# Altium project Sahasrara_PCB.PrjPcb
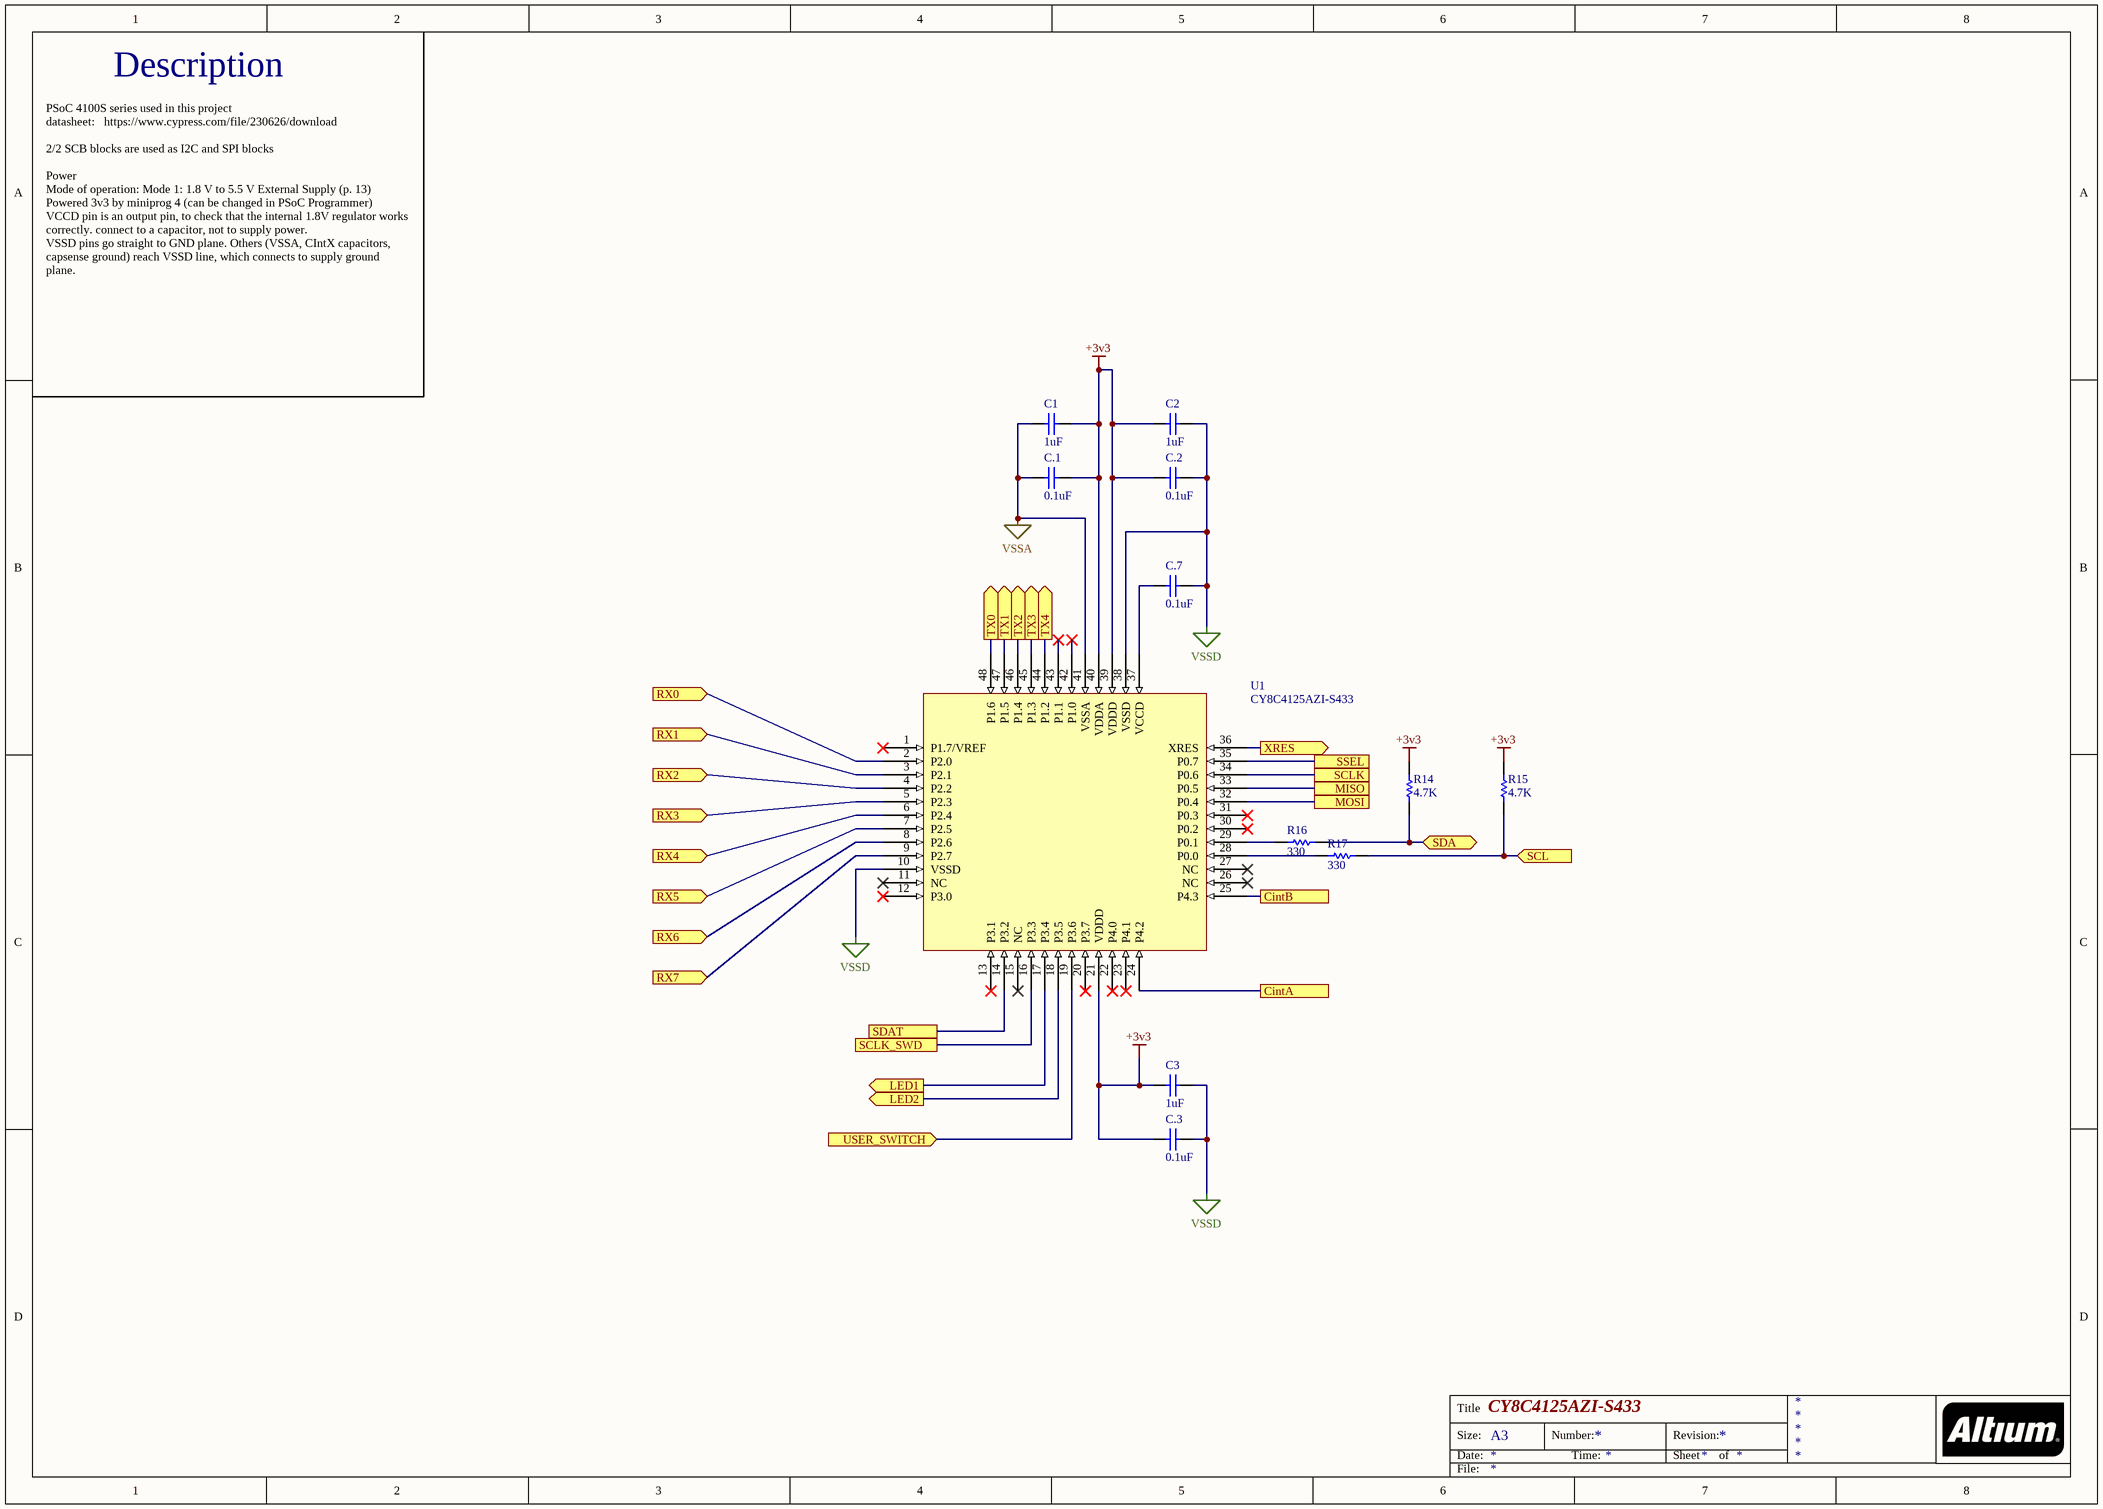
[diagram p0: CY8C4125AZI-S433.SchDoc]
4 sheets, 44 parts. Net scope: flat (ports and power ports of the same name join across sheets).
Board file: Sahasrara_Large-1_review_chandra.PcbDoc
Sheets:
  CY8C4125AZI-S433.SchDoc
  CSX_Capsense.SchDoc
  Comm.SchDoc
  Power.SchDoc

## Sheet CY8C4125AZI-S433.SchDoc: CY8C4125AZI-S433
size A3

### Parts
C1  1uF  [CAPC0603(1608)100_N]
C2  1uF  [CAPC0603(1608)100_N]
C3  1uF  [CAPC0603(1608)100_N]
C.1  0.1uF  [CAPC0603(1608)100_N]
C.2  0.1uF  [CAPC0603(1608)100_N]
C.3  0.1uF  [CAPC0603(1608)100_N]
C.7  0.1uF  [CAPC0603(1608)100_N]
R14  4.7K  [RESC1608X55X25ML10T15]
R15  4.7K  [RESC1608X55X25ML10T15]
R16  330  [RESC0603(1608)_L]
R17  330  [RESC0603(1608)_L]
U1  CY8C4125AZI-S433  [CY8C4125AZI-S433]

### Ports
CintA, CintB, LED1 (out), LED2 (out), MISO, MOSI, RX0 (in), RX1 (in), RX2 (in), RX3 (in), RX4 (in), RX5 (in), RX6 (in), RX7 (in), SCL (in), SCLK, SCLK_SWD, SDA (bidir), SDAT, SSEL, TX0 (out), TX1 (out), TX2 (out), TX3 (out), TX4 (out), USER_SWITCH (in), XRES (out)

### Nets
+3v3: C1.2 C2.1 C3.1 C.1.2 C.2.1 C.3.1 R14.2 R15.2 U1.21(VDDD) U1.39(VDDD) U1.40(VDDA)
VSSA: C1.1 C.1.1 U1.41(VSSA)
VSSD: C2.2 C3.2 C.2.2 C.3.2 C.7.2 U1.10(VSSD) U1.38(VSSD)
CintA: U1.24(P4.2) ; port CintA
CintB: U1.25(P4.3) ; port CintB
LED1: U1.17(P3.4) ; port LED1
LED2: U1.18(P3.5) ; port LED2
MISO: U1.33(P0.5) ; port MISO
MOSI: U1.32(P0.4) ; port MOSI
RX0: U1.2(P2.0) ; port RX0
RX1: U1.3(P2.1) ; port RX1
RX2: U1.4(P2.2) ; port RX2
RX3: U1.5(P2.3) ; port RX3
RX4: U1.6(P2.4) ; port RX4
RX5: U1.7(P2.5) ; port RX5
RX6: U1.8(P2.6) ; port RX6
RX7: U1.9(P2.7) ; port RX7
SCL: R15.1 R17.2 ; port SCL
SCLK: U1.34(P0.6) ; port SCLK
SCLK_SWD: U1.16(P3.3) ; port SCLK_SWD
SDA: R14.1 R16.2 ; port SDA
SDAT: U1.14(P3.2) ; port SDAT
SSEL: U1.35(P0.7) ; port SSEL
TX0: U1.48(P1.6) ; port TX0
TX1: U1.47(P1.5) ; port TX1
TX2: U1.46(P1.4) ; port TX2
TX3: U1.45(P1.3) ; port TX3
TX4: U1.44(P1.2) ; port TX4
USER_SWITCH: U1.19(P3.6) ; port USER_SWITCH
XRES: U1.36(XRES) ; port XRES
NetC.7_1: C.7.1 U1.37(VCCD)
NetR16_1: R16.1 U1.29(P0.1)
NetR17_1: R17.1 U1.28(P0.0)

Not connected (* = marked no-connect by the designer): U1 1(P1.7/VREF)* 11(NC)* 12(P3.0)* 13(P3.1)* 15(NC)* 20(P3.7)* 22(P4.0)* 23(P4.1)* 26(NC)* 27(NC)* 30(P0.2)* 31(P0.3)* 42(P1.0)* 43(P1.1)*

### Notes on the sheet
- Description
- PSoC 4100S series used in this project
  datasheet:   https://www.cypress.com/file/230626/download
  2/2 SCB blocks are used as I2C and SPI blocks
  Power
  Mode of operation: Mode 1: 1.8 V to 5.5 V External Supply (p. 13)
  Powered 3v3 by miniprog 4 (can be changed in PSoC Programmer)
  VCCD pin is an output pin, to check that the internal 1.8V regulator works correctly. connect to a capacitor, not to supply power.
  VSSD pins go straight to GND plane. Others (VSSA, CIntX capacitors, capsense ground) reach VSSD line, which connects to supply ground plane.
- Title
- Size:
- Date:
- A3
- Number:
- Time:
- Revision:
- Sheet
- of
- File:

### Library data of the parts
C1-C3 = CMP-1035-02746-1: CAP 1uF 50V ±20% 0603 (1608 Metric) Thickness 1mm SMD; Tolerance: Â±20%; Case-EIA: 0603; Case-Metric: 1608; Value: 1uF; Technology: SMT; Max Thickness: 1 mm; Rated Voltage: 50 V
C.1-C.3 C.7 = CMP-1035-02746-1: CAP 0.1 uF 50V ±20% 0603 (1608 Metric) Thickness 1mm SMD; Tolerance: Â±20%; Value: 1uF; Case-EIA: 0603; Case-Metric: 1608; Technology: SMT; Max Thickness: 1 mm; Rated Voltage: 50 V
R14 R15 = CMP-2000-05024-1: RC0603JR-074K7L Chip Resistor, 4.7 KOhm, +/- 5%, 100 mW, -55 to 155 degC, 0603 (1608 Metric), RoHS, Tape and Reel; Manufacturer: Yageo; Resistance: 4.7kOhms; Temperature Coefficient: 100PPM/C; Power Rating: 100mW; Voltage Rating: 50V; Operating Temperature Range: -55Cto+155C; Case Code - mm: 1608; Tolerance: 5%; Product: ThickFilmResistorsGeneralPurpose; Case Code - in: 0603; Datasheet URL: http://www.yageo.com/documents/recent/PYu-RC_Group_51_RoHS_L_04.pdf; Package Reference: 603; Datasheet Version: Rev. 4, 02/2016; Package Description: 2-Pin Surface Mount Device, Body 1.6 x 0.8 mm; Manufacturer URL: http://www.yageo.com/; Series: RC; Packaging: Reel; Termination Style: SMD/SMT
R16 R17 = CMP-1012-00062-1: 330R 0.1W 5% 0603 (1608 Metric)  SMD; Value: 330.00 Ohm; Case-EIA: 0603; Case-Metric: 1608; Tolerance: 5 %; Power: 0.1 W; Technology: SMT

## Sheet CSX_Capsense.SchDoc
size A3
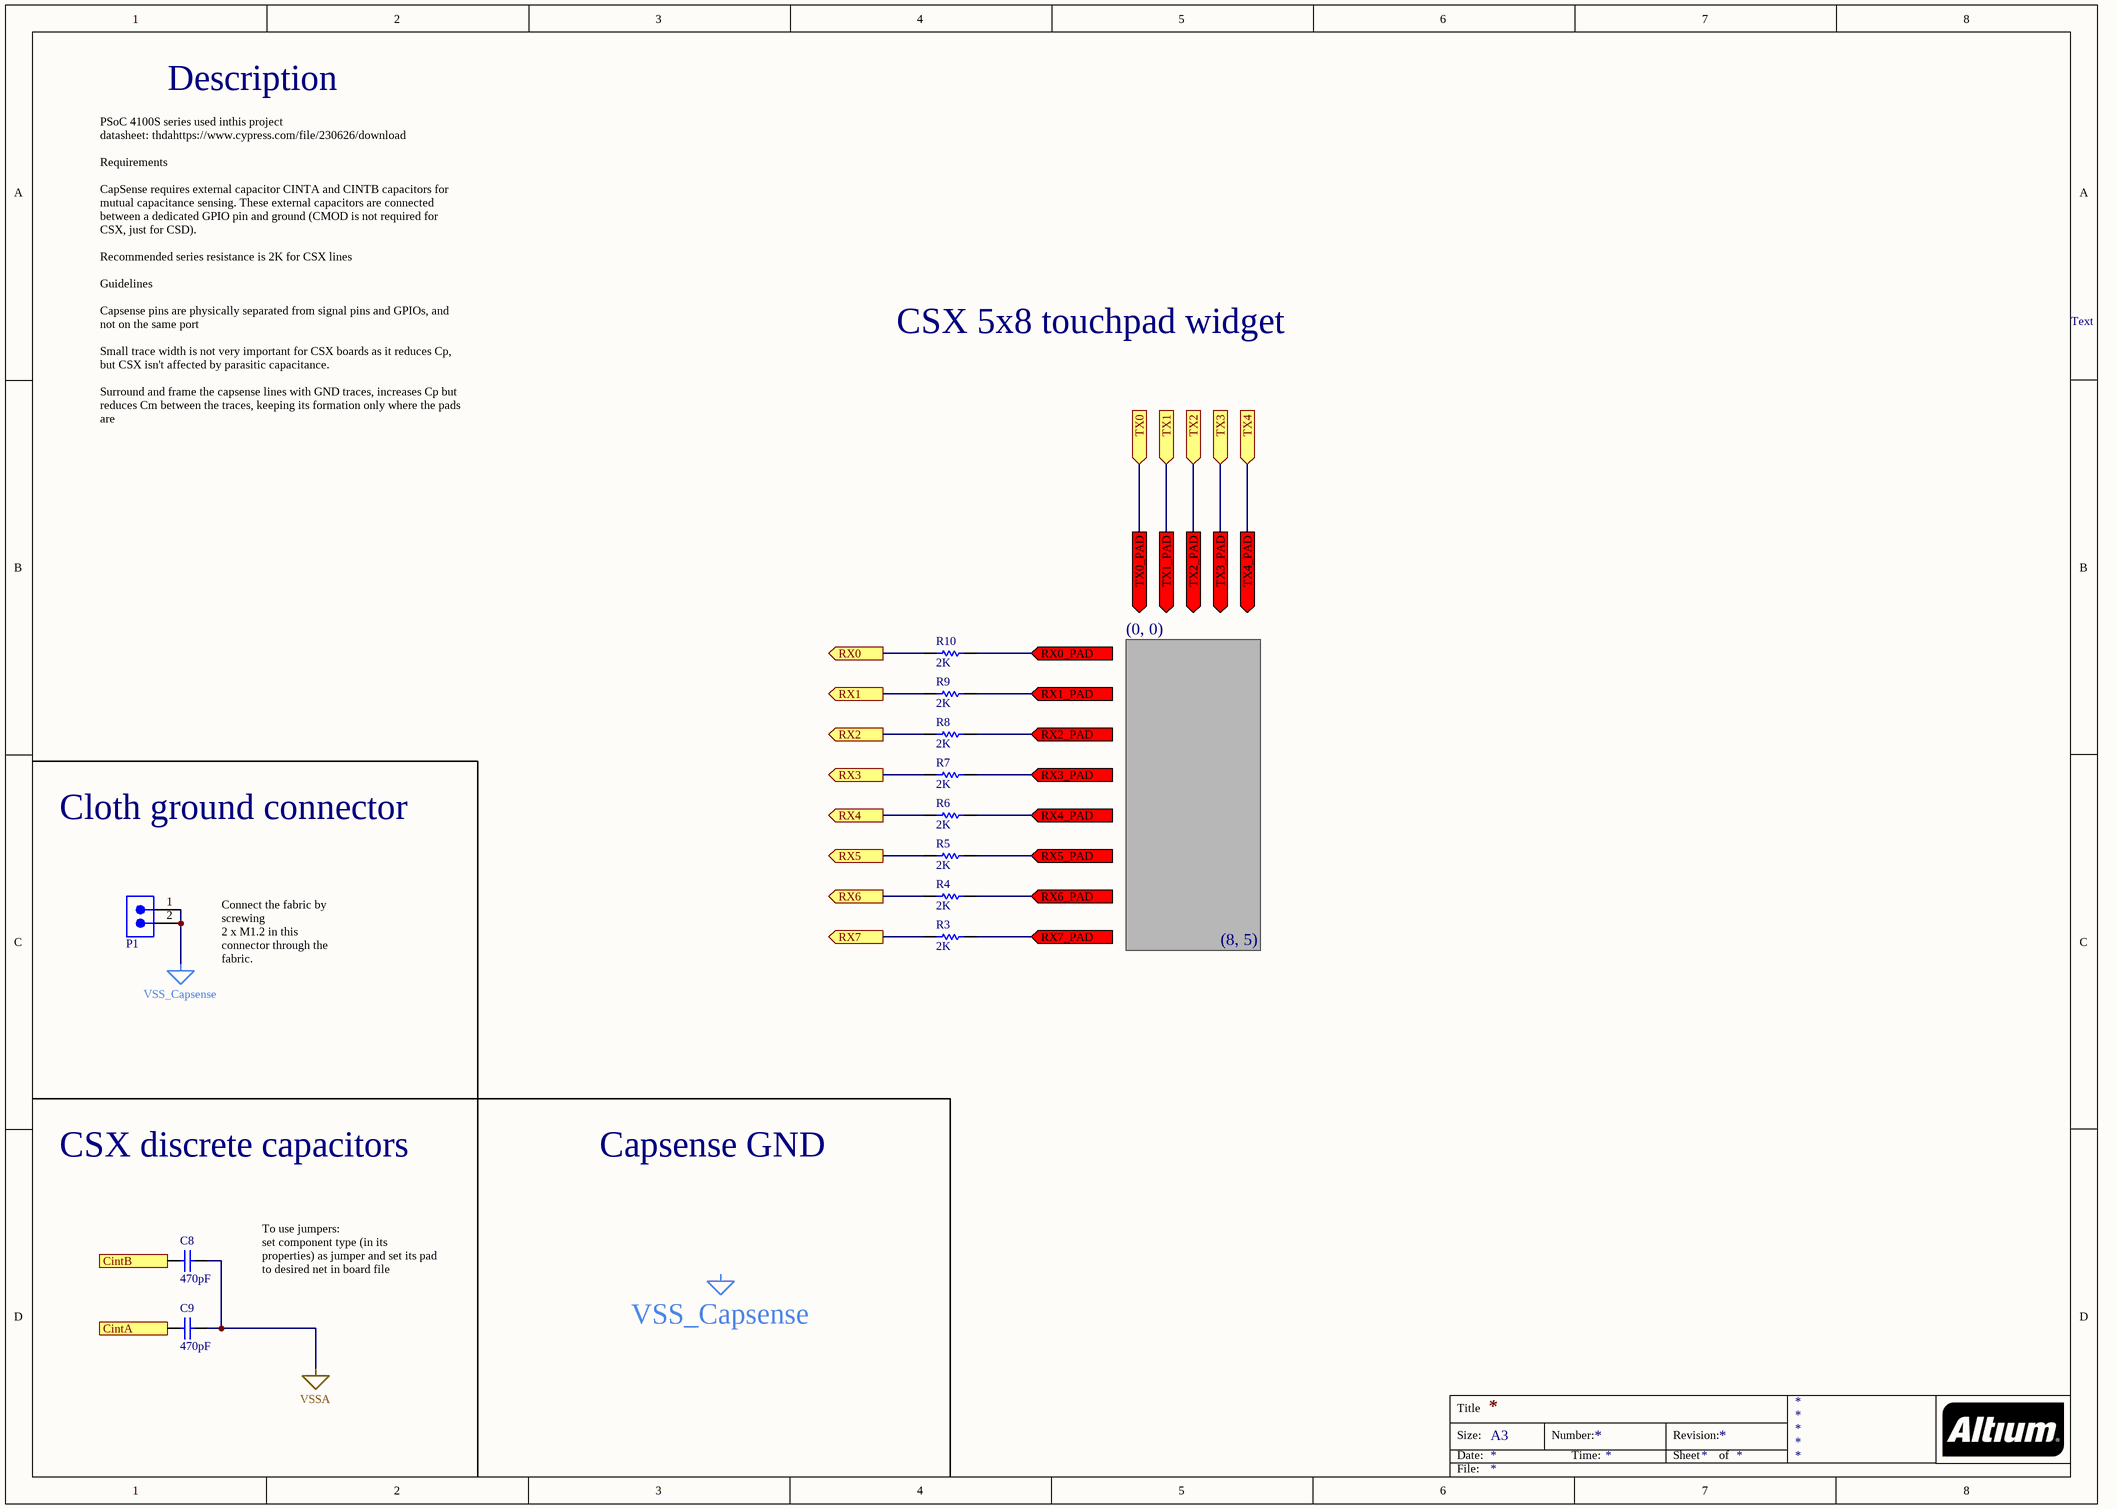
[diagram p1: CSX_Capsense.SchDoc]

### Parts
C8  470pF  [CAPC0603(1608)100_N]
C9  470pF  [CAPC0603(1608)100_N]
P1  MTLW-102-05-T-S-172  [SMTC-MTLW-102-05-X-S-172]  (value not drawn)
R3  2K  [RESC0603(1608)_N]
R4  2K  [RESC0603(1608)_N]
R5  2K  [RESC0603(1608)_N]
R6  2K  [RESC0603(1608)_N]
R7  2K  [RESC0603(1608)_N]
R8  2K  [RESC0603(1608)_N]
R9  2K  [RESC0603(1608)_N]
R10  2K  [RESC0603(1608)_N]

### Ports
CintA, CintB, RX0 (out), RX0_PAD (in), RX1 (out), RX1_PAD (in), RX2 (out), RX2_PAD (in), RX3 (out), RX3_PAD (in), RX4 (out), RX4_PAD (in), RX5 (out), RX5_PAD (in), RX6 (out), RX6_PAD (in), RX7 (out), RX7_PAD (in), TX0 (in), TX0_PAD (out), TX1 (in), TX1_PAD (out), TX2 (in), TX2_PAD (out), TX3 (in), TX3_PAD (out), TX4 (in), TX4_PAD (out)

### Nets
VSS_Capsense: P1.1 P1.2
VSSA: C8.2 C9.2
CintA: C9.1 ; port CintA
CintB: C8.1 ; port CintB
RX0: R10.1 ; port RX0
RX0_PAD: R10.2 ; port RX0_PAD
RX1: R9.1 ; port RX1
RX1_PAD: R9.2 ; port RX1_PAD
RX2: R8.1 ; port RX2
RX2_PAD: R8.2 ; port RX2_PAD
RX3: R7.1 ; port RX3
RX3_PAD: R7.2 ; port RX3_PAD
RX4: R6.1 ; port RX4
RX4_PAD: R6.2 ; port RX4_PAD
RX5: R5.1 ; port RX5
RX5_PAD: R5.2 ; port RX5_PAD
RX6: R4.1 ; port RX6
RX6_PAD: R4.2 ; port RX6_PAD
RX7: R3.1 ; port RX7
RX7_PAD: R3.2 ; port RX7_PAD
TX0: port TX0, port TX0_PAD
TX1: port TX1, port TX1_PAD
TX2: port TX2, port TX2_PAD
TX3: port TX3, port TX3_PAD
TX4: port TX4, port TX4_PAD

### Notes on the sheet
- Description
- CSX 5x8 touchpad widget
- Text
- PSoC 4100S series used inthis project
  datasheet: thdahttps://www.cypress.com/file/230626/download
  Requirements
  CapSense requires external capacitor CINTA and CINTB capacitors for mutual capacitance sensing. These external capacitors are connected between a dedicated GPIO pin and ground (CMOD is not required for CSX, just for CSD).
  Recommended series resistance is 2K for CSX lines
  Guidelines
  Capsense pins are physically separated from signal pins and GPIOs, and not on the same port
  Small trace width is not very important for CSX boards as it reduces Cp, but CSX isn't affected by parasitic capacitance.
  Surround and frame the capsense lines with GND traces, increases Cp but reduces Cm between the traces, keeping its formation only where the pads are
- (0, 0)
- Cloth ground connector
- Connect the fabric by screwing
  2 x M1.2 in this connector through the fabric.
- (8, 5)
- CSX discrete capacitors
- Capsense GND
- To use jumpers:
  set component type (in its properties) as jumper and set its pad to desired net in board file
- Labels drawn without touching a wire or pin: VSS_Capsense
- Title
- Size:
- Date:
- A3
- Number:
- Time:
- Revision:
- Sheet
- of
- File:

### Library data of the parts
C8 C9 = CMP-1035-01661-1: CAP 470pF 10V ±10% 0603 (1608 Metric) Thickness 1mm SMD; Case-EIA: 0603; Tolerance: Â±10%; Case-Metric: 1608; Max Thickness: 1 mm; Rated Voltage: 10 V; Technology: SMT; Value: 470pF
P1 = CMP-1024-00065-1: Low Profile .025" SQ Post Header, Through-hole, Vertical, -55 to 105 degC, 2.54 mm Pitch, 2-Pin, Male, RoHS; Manufacturer: Samtec; Pitch: 2.54 mm; ComponentLink2URL: http://www.samtec.com/documents/webfiles/pdf/MTLW_TH.PDF; PackageReference: MTLW-102-05-X-S-172; Mounting Technology: Through-hole; DatasheetVersion: F-214; Temperature Range: -55 to 105 degC; ComponentLink2Description: Datasheet; Orientation: Vertical; ComponentLink3Description: Package Specification; RoHS: True; PackageDescription: Low Profile Terminal Assembly; ComponentLink3URL: http://www.samtec.com/documents/webfiles/cpdf/MTLW-1XX-XX-XX-X-XXX-XX-XX-MKT1.pdf; ComponentLink1Description: Manufacturer URL; PartNumber: MTLW-102-05-T-S-172; PackageVersion: T, 6/1991; ComponentLink1URL: http://www.samtec.com
R3-R10 = CMP-1012-00081-1: 2K 0.1W 5% 0603 (1608 Metric)  SMD; Case-Metric: 1608; Value: 2000.00 Ohm; Case-EIA: 0603; Tolerance: 5 %; Technology: SMT; Power: 0.1 W

## Sheet Comm.SchDoc
size A3
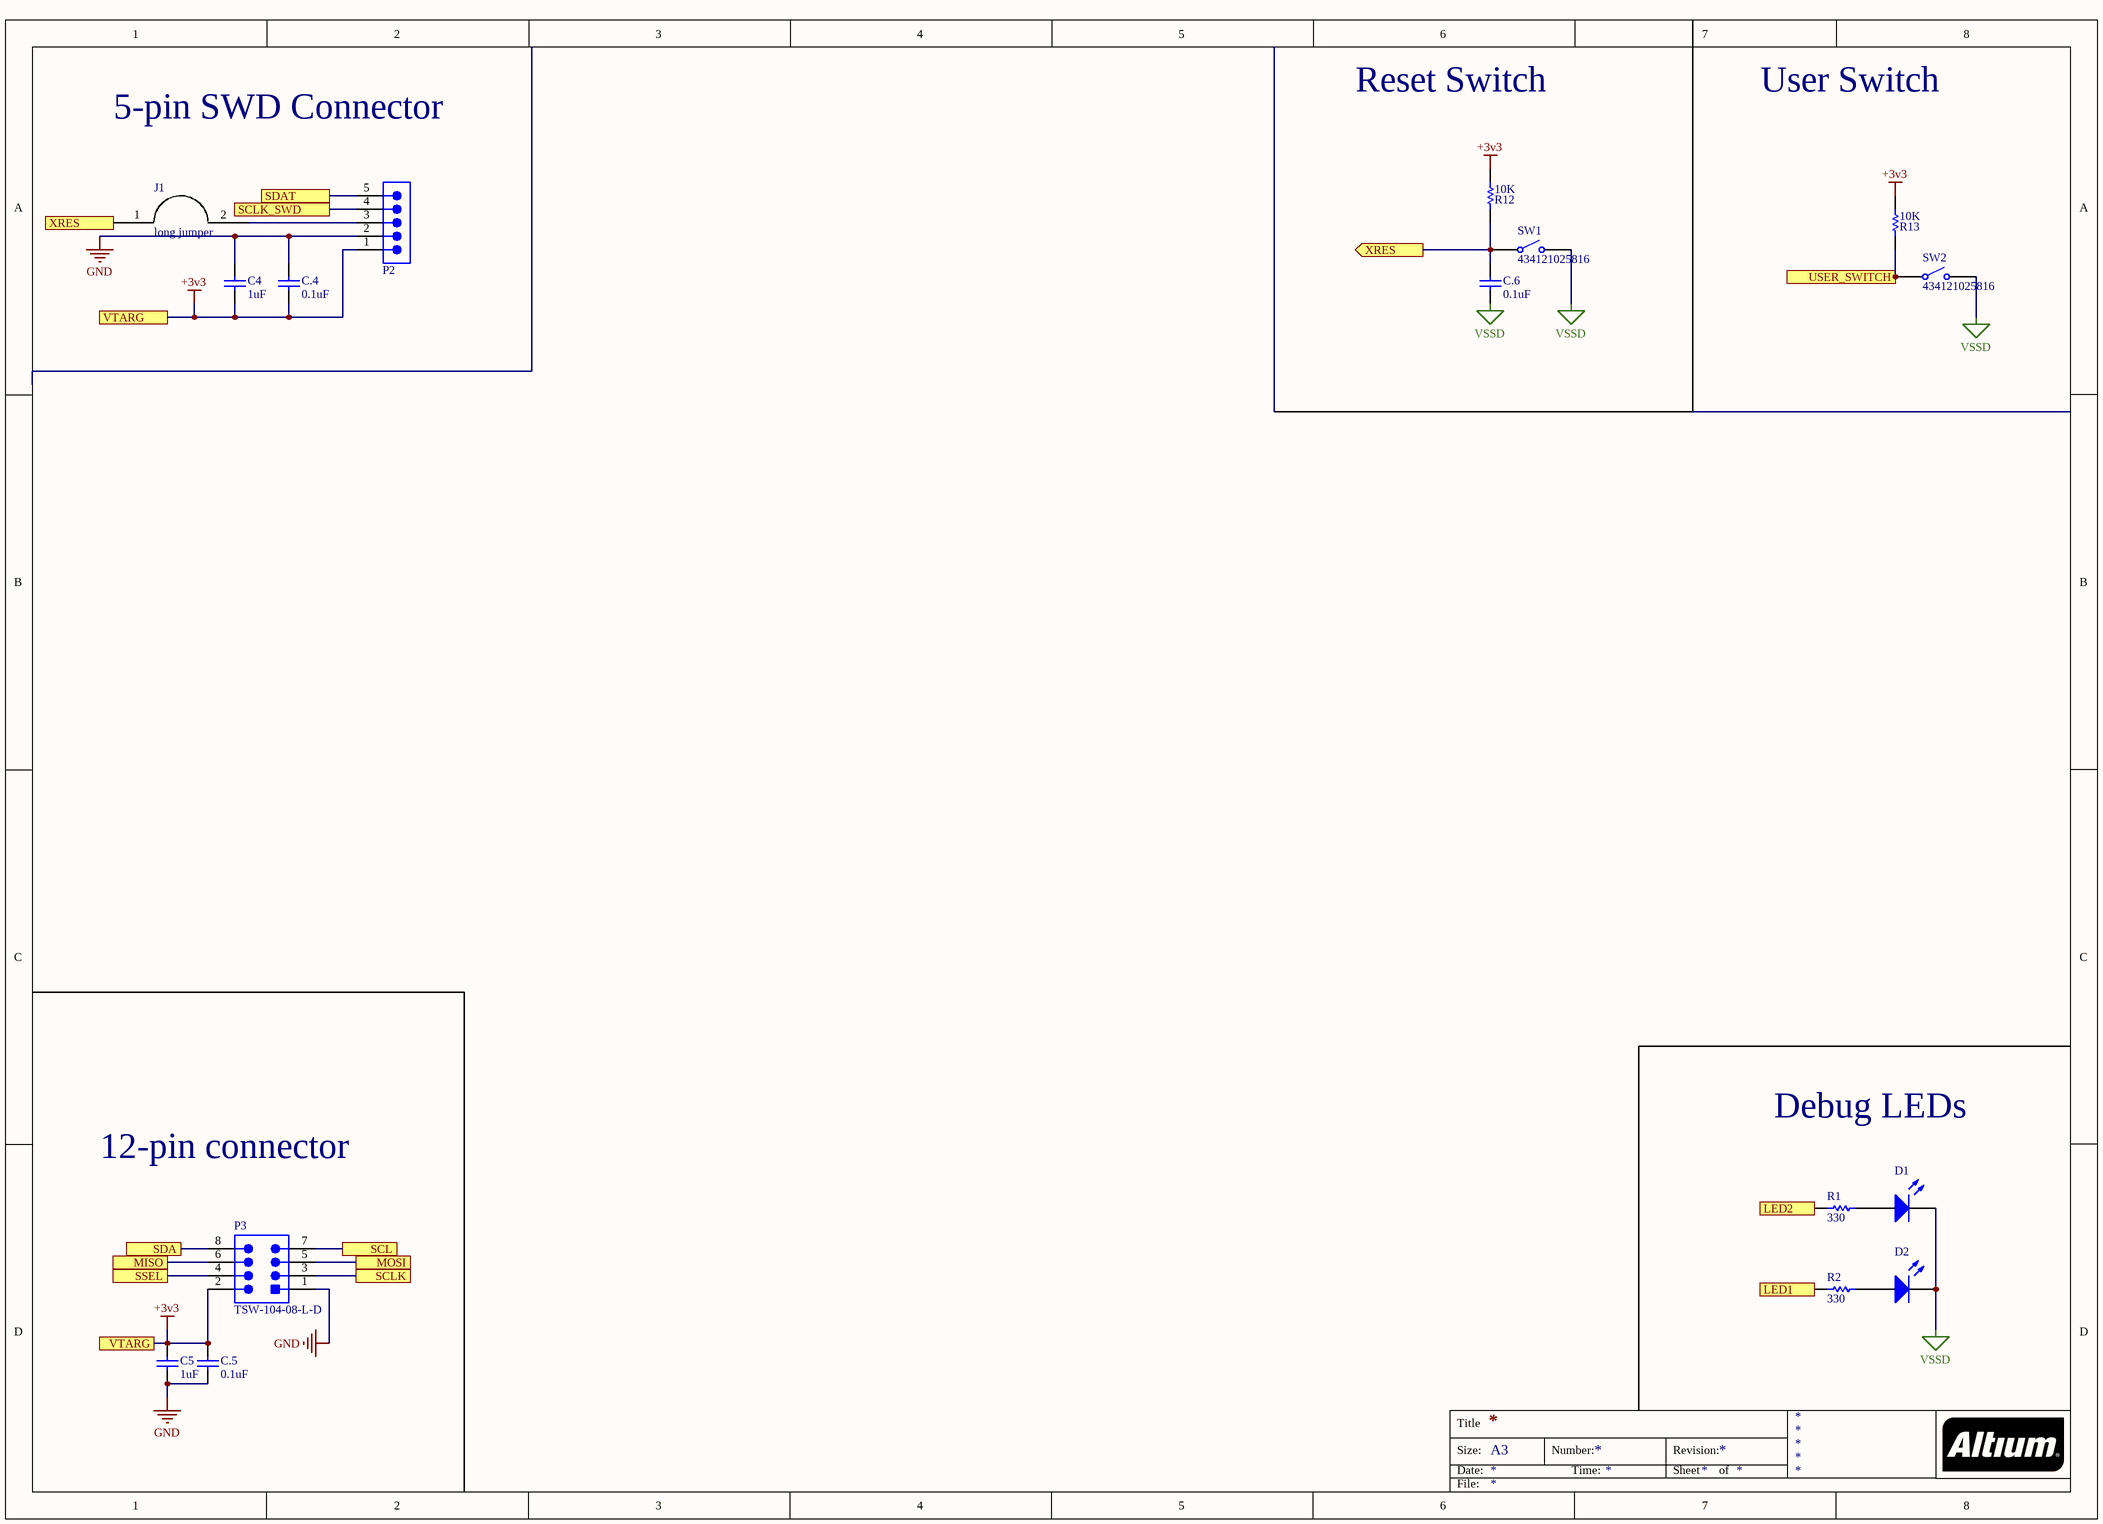
[diagram p2: Comm.SchDoc]

### Parts
C4  1uF  [CAPC0603(1608)100_N]
C5  1uF  [CAPC0603(1608)100_N]
C.4  0.1uF  [CAPC0603(1608)100_N]
C.5  0.1uF  [CAPC0603(1608)100_N]
C.6  0.1uF  [CAPC0603(1608)100_N]
D1  150060BS75000  [0603_A]  (value not drawn)
D2  150060BS75000  [0603_A]  (value not drawn)
J1  long jumper  [PCBComponent_1]
P2  MTLW-105-05-L-S-190  [SMTC-MTLW-105-05-X-S-190]  (value not drawn)
P3  TSW-104-08-L-D  [SMTC-TSW-104-08-L-D_V]
R1  330  [RESC0603(1608)_L]
R2  330  [RESC0603(1608)_L]
R12  10K  [RESC1608X55X25ML10T15]
R13  10K  [RESC1608X55X25ML10T15]
SW1  434121025816  [434121025816]
SW2  434121025816  [434121025816]

### Ports
LED1 (in), LED2 (in), MISO, MOSI, SCL, SCLK, SCLK_SWD, SDA, SDAT, SSEL, USER_SWITCH, VTARG, XRES, XRES (out)

### Nets
+3v3: C4.1 C5.2 C.4.1 C.5.2 P2.1 P3.2 R12.2 R13.2 ; port VTARG
GND: C4.2 C5.1 C.4.2 C.5.1 P2.2 P3.1
VSSD: C.6.1 D1.1(K) D2.1(K) SW1.2 SW2.2
LED1: R2.1 ; port LED1
LED2: R1.1 ; port LED2
MISO: P3.6 ; port MISO
MOSI: P3.5 ; port MOSI
SCL: P3.7 ; port SCL
SCLK: P3.3 ; port SCLK
SCLK_SWD: P2.4 ; port SCLK_SWD
SDA: P3.8 ; port SDA
SDAT: P2.5 ; port SDAT
SSEL: P3.4 ; port SSEL
USER_SWITCH: R13.1 SW2.1 ; port USER_SWITCH
XRES: C.6.2 J1.1 R12.1 SW1.1 ; port XRES
NetD1_2: D1.2(A) R1.2
NetD2_2: D2.2(A) R2.2
NetJ1_2: J1.2 P2.3

### Notes on the sheet
- 5-pin SWD Connector
- Reset Switch
- User Switch
- Debug LEDs
- 12-pin connector
- Title
- Size:
- Date:
- A3
- Number:
- Time:
- Revision:
- Sheet
- of
- File:

### Library data of the parts
C4 C5 = CMP-1035-02746-1: as C1 on sheet CY8C4125AZI-S433; Value: 1uF; Technology: SMT; Max Thickness: 1 mm; Rated Voltage: 50 V
C.4-C.6 = CMP-1035-02746-1: as C.1 on sheet CY8C4125AZI-S433; Technology: SMT; Max Thickness: 1 mm; Rated Voltage: 50 V
D1 D2 = CMP-1426-00003-1: SMD mono-color Chip LED, WL-SMCW, Blue; Manufacturer: Wuerth Elektronik; Color: Blue; ComponentLink2Description: Datasheet; ComponentLink2URL: http://katalog.we-online.com/led/datasheet/150060BS75000.pdf; ComponentLink1URL: http://www.we-online.com; PackageReference: 0603_A; PartNumber: 150060BS75000; ComponentLink1Description: Manufacturer URL
P2 = CMP-1024-00079-1: Low Profile .025" SQ Post Header, Through-hole, Vertical, -55 to 125 degC, 2.54 mm Pitch, 5-Pin, Male, RoHS; Manufacturer: Samtec; Pitch: 2.54 mm; Mounting Technology: Through-hole; ComponentLink2Description: Datasheet; DatasheetVersion: F-214; Temperature Range: -55 to 125 degC; ComponentLink1Description: Manufacturer URL; Orientation: Vertical; ComponentLink2URL: http://www.samtec.com/documents/webfiles/pdf/MTLW_TH.PDF; PackageDescription: Low Profile Terminal Assembly; PackageVersion: T, 6/1991; RoHS: True; ComponentLink3Description: Package Specification; ComponentLink1URL: http://www.samtec.com; PackageReference: MTLW-105-05-X-S-190; ComponentLink3URL: http://www.samtec.com/documents/webfiles/cpdf/MTLW-1XX-XX-XX-X-XXX-XX-XX-MKT1.pdf; PartNumber: MTLW-105-05-L-S-190
P3 = CMP-1681-00006-4: Male Header, Pitch 2.54 mm, 2 x 4 Position, Height 8.38 mm, Tail Length 5.08 mm, -55 to 125 degC, RoHS, Bulk; Manufacturer: Samtec; Voltage Rating: 550 V; Current Rating: 7.6 A; Rows: 2; ComponentLink2URL: https://datasheet.ciiva.com/25616/0900766b81154476-25616879.pdf; Package Quantity: 1; PackageDescription: Male Header, Pitch 2.54 mm, 2 x 4 Position, Height 8.38 mm, Tail Length 5.08 mm; ComponentLink1Description: Manufacturer URL; Lead Pitch: 0.1 inch; REACH SVHC: No SVHC; Mounting Technology: Through Hole; PackageReference: TSW-104-08-L-D; Contact Plating: Gold; DatasheetVersion: 04/2012; Colour: Black; Contact Finish: Gold; ComponentLink3URL: http://suddendocs.samtec.com/prints/tsw-xxx-xx-x-x-xx-xxx-footprint.pdf; ComponentLink3Description: Package Specification; Mount: Through Hole; RoHSCompliant: true; Packaging: Bulk; ComponentLink2Description: Datasheet; Contact Material: Bronze; Pins: 8; ComponentLink1URL: http://www.samtec.com/
R1 R2 = CMP-1012-00062-1: as R16 on sheet CY8C4125AZI-S433; Tolerance: 5 %; Power: 0.1 W; Technology: SMT
R12 R13 = CMP-2000-05024-1: Chip Resistor, 4.7 KOhm, +/- 5%, 100 mW, -55 to 155 degC, 0603 (1608 Metric), RoHS, Tape and Reel; Manufacturer: Yageo; Resistance: 4.7kOhms; Temperature Coefficient: 100PPM/C; Power Rating: 100mW; Voltage Rating: 50V; Operating Temperature Range: -55Cto+155C; Case Code - mm: 1608; Tolerance: 5%; Product: ThickFilmResistorsGeneralPurpose; Case Code - in: 0603; Datasheet URL: http://www.yageo.com/documents/recent/PYu-RC_Group_51_RoHS_L_04.pdf; Package Reference: 603; Datasheet Version: Rev. 4, 02/2016; Package Description: 2-Pin Surface Mount Device, Body 1.6 x 0.8 mm; Manufacturer URL: http://www.yageo.com/; Series: RC; Packaging: Reel; Termination Style: SMD/SMT
SW1 SW2 = CMP-1459-00004-1: WS-TASV SMD Tact Switch 6.0X3.8 mm; Manufacturer: Wuerth Elektronik; NoPins: 02; PackageReference: 434121025816; ComponentLink2URL: http://katalog.we-online.de/em/datasheet/434121025816.pdf; PartNumber: 434121025816; ComponentLink2Description: Datasheet; ComponentLink1URL: http://www.we-online.com; ComponentLink1Description: Manufacturer URL

## Sheet Power.SchDoc
size A4
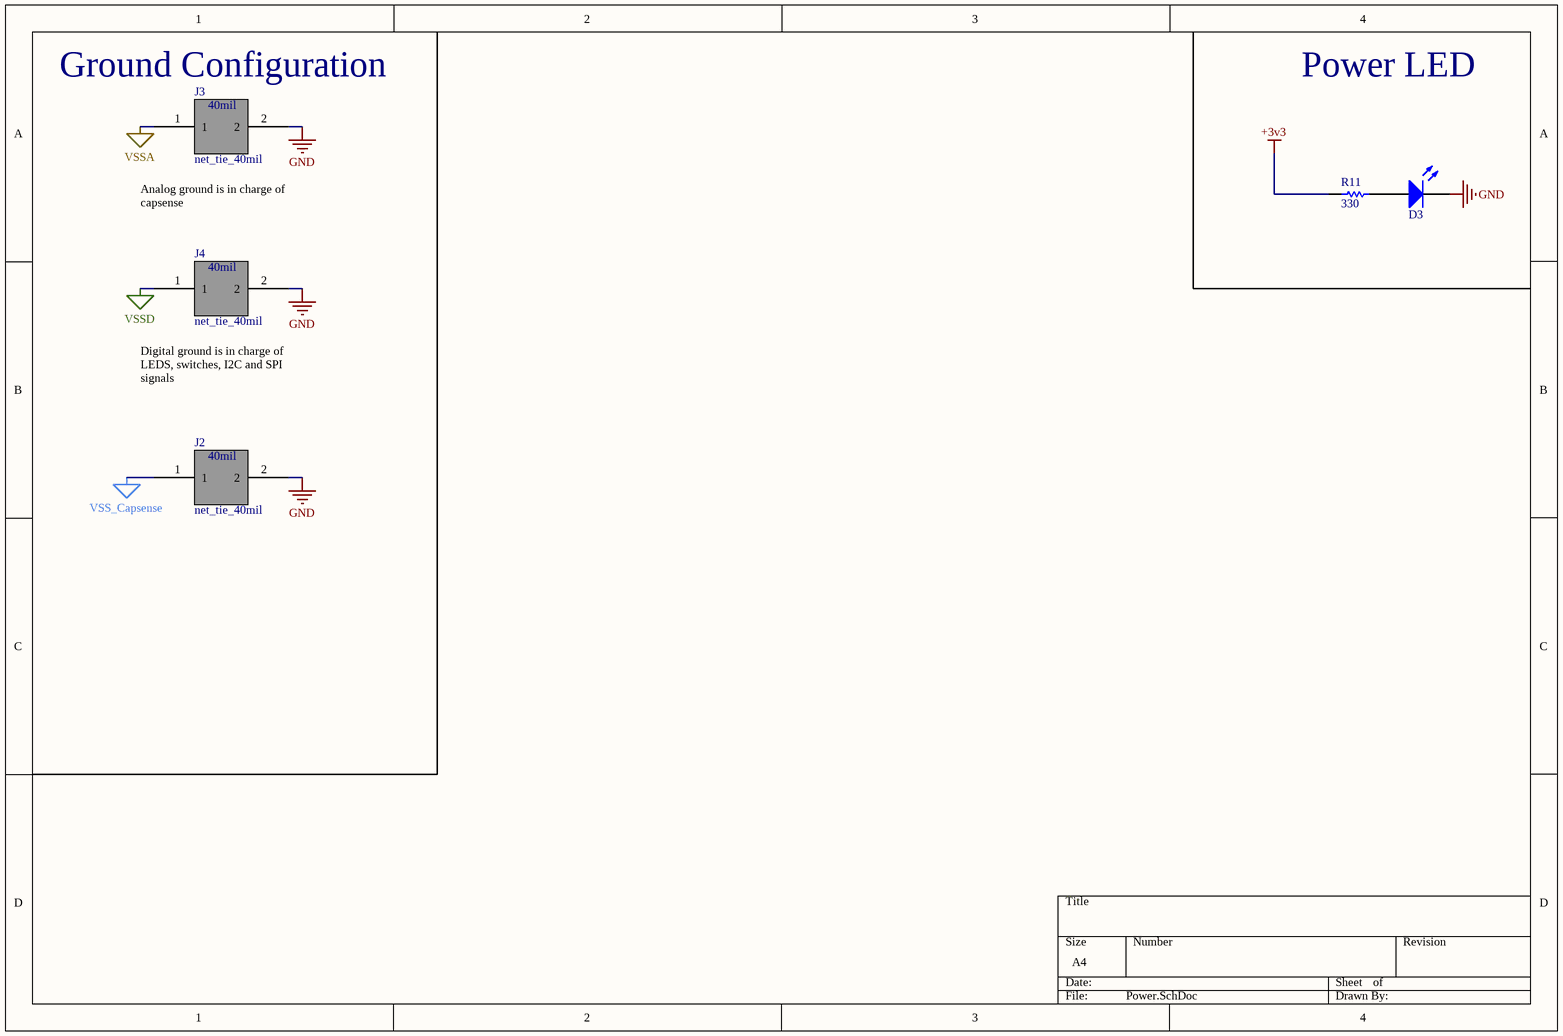
[diagram p3: Power.SchDoc]

### Parts
D3  150060BS75000  [0603_A]  (value not drawn)
J2  net_tie_40mil  [net_tie]  (net tie, no BOM)
J3  net_tie_40mil  [net_tie]  (net tie, no BOM)
J4  net_tie_40mil  [net_tie]  (net tie, no BOM)
R11  330  [RESC0603(1608)_L]

### Nets
+3v3: R11.1
GND: D3.1(K) J2.2 J3.2 J4.2
VSS_Capsense: J2.1
VSSA: J3.1
VSSD: J4.1
NetD3_2: D3.2(A) R11.2

### Notes on the sheet
- (near J3) Ground Configuration
- Power LED
- (near J4) Analog ground is in charge of capsense
- Digital ground is in charge of LEDS, switches, I2C and SPI signals
- (in symbol net_tie_40mil) 40mil

### Library data of the parts
D3 = CMP-1426-00003-1: as D1 on sheet Comm; Color: Blue; ComponentLink2Description: Datasheet; ComponentLink2URL: http://katalog.we-online.com/led/datasheet/150060BS75000.pdf; ComponentLink1URL: http://www.we-online.com; PackageReference: 0603_A; PartNumber: 150060BS75000; ComponentLink1Description: Manufacturer URL
R11 = CMP-1012-00062-1: as R16 on sheet CY8C4125AZI-S433; Tolerance: 5 %; Power: 0.1 W; Technology: SMT

## Nets that join several sheets
+3v3: CY8C4125AZI-S433 (11 pins), Comm (8 pins), Power (R11.1)
GND: Comm (6 pins), Power (D3.1 J2.2 J3.2 J4.2)
VSS_Capsense: CSX_Capsense (P1.1 P1.2), Power (J2.1)
VSSA: CY8C4125AZI-S433 (C1.1 C.1.1 U1.41), CSX_Capsense (C8.2 C9.2), Power (J3.1)
VSSD: CY8C4125AZI-S433 (7 pins), Comm (5 pins), Power (J4.1)
CintA: CY8C4125AZI-S433 (U1.24), CSX_Capsense (C9.1)
CintB: CY8C4125AZI-S433 (U1.25), CSX_Capsense (C8.1)
LED1: CY8C4125AZI-S433 (U1.17), Comm (R2.1)
LED2: CY8C4125AZI-S433 (U1.18), Comm (R1.1)
MISO: CY8C4125AZI-S433 (U1.33), Comm (P3.6)
MOSI: CY8C4125AZI-S433 (U1.32), Comm (P3.5)
RX0: CY8C4125AZI-S433 (U1.2), CSX_Capsense (R10.1)
RX1: CY8C4125AZI-S433 (U1.3), CSX_Capsense (R9.1)
RX2: CY8C4125AZI-S433 (U1.4), CSX_Capsense (R8.1)
RX3: CY8C4125AZI-S433 (U1.5), CSX_Capsense (R7.1)
RX4: CY8C4125AZI-S433 (U1.6), CSX_Capsense (R6.1)
RX5: CY8C4125AZI-S433 (U1.7), CSX_Capsense (R5.1)
RX6: CY8C4125AZI-S433 (U1.8), CSX_Capsense (R4.1)
RX7: CY8C4125AZI-S433 (U1.9), CSX_Capsense (R3.1)
SCL: CY8C4125AZI-S433 (R15.1 R17.2), Comm (P3.7)
SCLK: CY8C4125AZI-S433 (U1.34), Comm (P3.3)
SCLK_SWD: CY8C4125AZI-S433 (U1.16), Comm (P2.4)
SDA: CY8C4125AZI-S433 (R14.1 R16.2), Comm (P3.8)
SDAT: CY8C4125AZI-S433 (U1.14), Comm (P2.5)
SSEL: CY8C4125AZI-S433 (U1.35), Comm (P3.4)
USER_SWITCH: CY8C4125AZI-S433 (U1.19), Comm (R13.1 SW2.1)
XRES: CY8C4125AZI-S433 (U1.36), Comm (C.6.2 J1.1 R12.1 SW1.1)